# EAGLE design Dimmer_1K_0.1 (EAGLE 5.04)
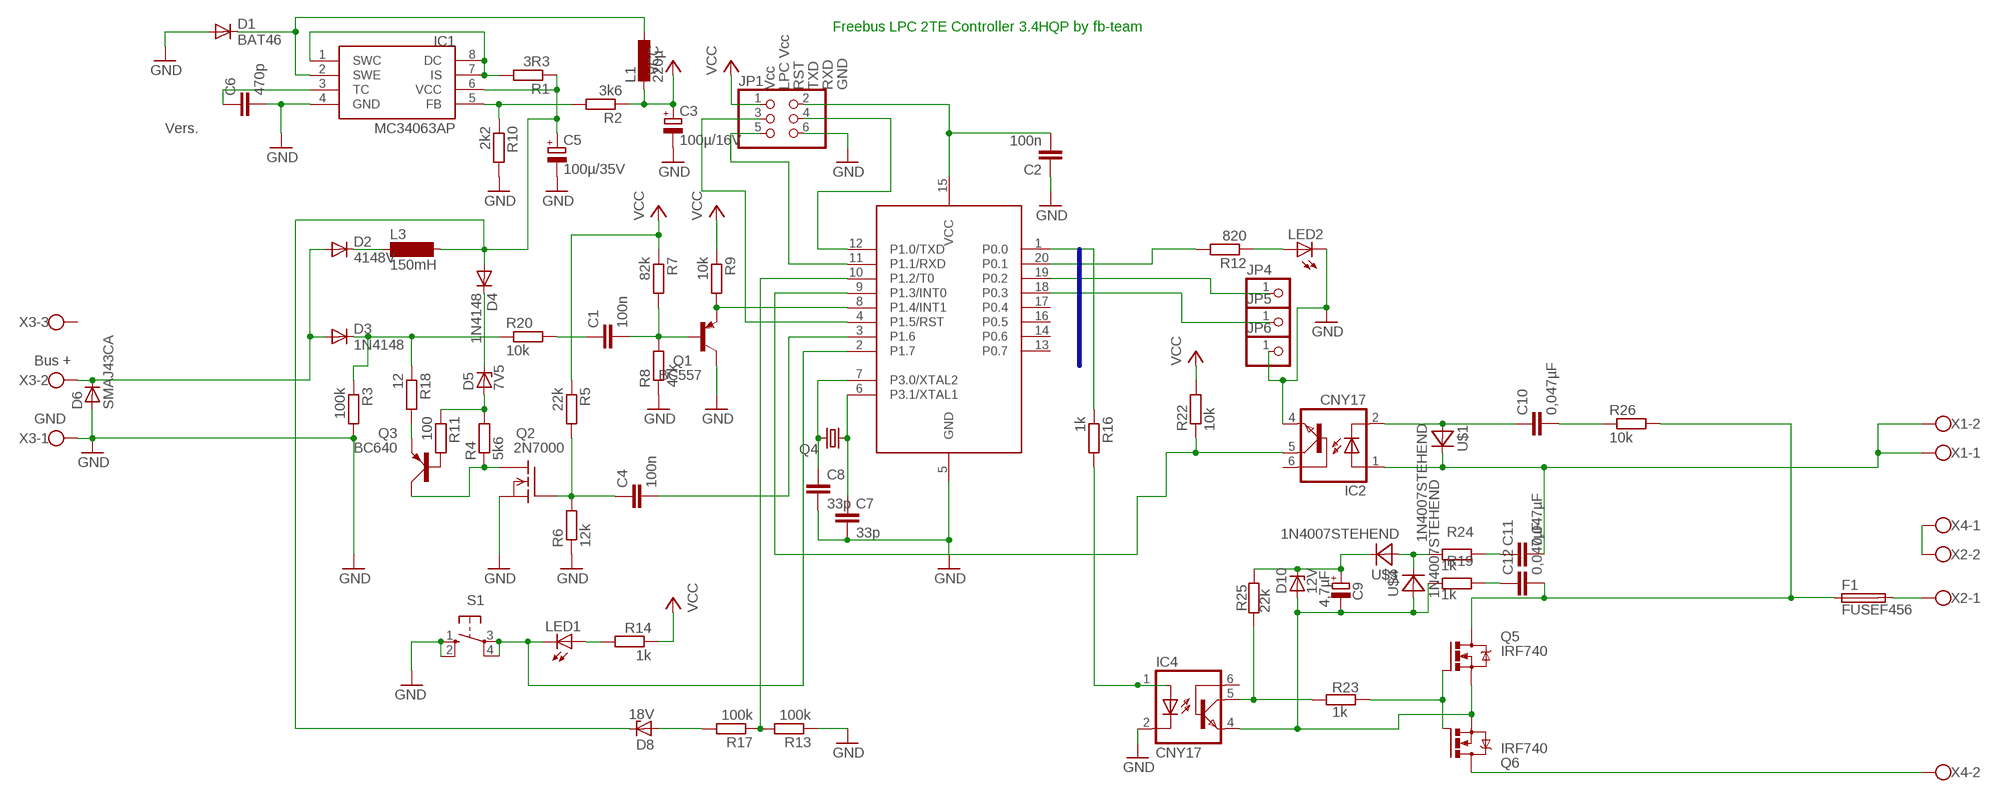
[diagram p0: schematic, sheet 1]

## Parts
C1  100n  C-EU050-024X044  [C050-024X044]
C2  100n  C-EU050-024X044  [C050-024X044]
C3  100µ/16V  CPOL-EUE2.5-5  [E2,5-5]
C4  100n  C-EU050-024X044  [C050-024X044]
C5  100µ/35V  CPOL-EUE3.5-8  [E3,5-8]
C6  470p  C-EU025-024X044  [C025-024X044]
C7  33p  C-EU025-025X050  [C025-025X050]
C8  33p  C-EU025-025X050  [C025-025X050]
C9  4,7µF  CPOL-EUE2-4  [E2-4]
C10  0,047µF  C-EU075-063X106  [C075-063X106]
C11  0,047µF  C-EU075-063X106  [C075-063X106]
C12  0,047µF  C-EU075-063X106  [C075-063X106]
D1  BAT46  BAT81  [DO34-7]
D2  4148V  1N41481448V  [D-2.5]
D3  1N4148  1N41481448V  [D-2.5]
D4  1N4148  1N41481448V  [D-2.5]
D5  7V5  ZPD  [DO35Z10]
D6  SMAJ43CA  D-SMB  [SMB]
D8  18V  ZPD  [DO35Z10]
D10  12V  ZPD  [DO35Z10]
F1  FUSEF456  [F456]
IC1  MC34063AP  [DIL08]
IC2  CNY17  [DIL06]
IC4  CNY17  [DIL06]
JP1  PINHD-2X3  [2X03]
JP4  PINHD-1X1  [1X01]
JP5  PINHD-1X1  [1X01]
JP6  PINHD-1X1  [1X01]
L1  220µ  L-EU0207/5V  [0207/5V@1]
L3  150mH  BS11  [BS11]
LED1  LED3MM  [LED3MM]
LED2  LED3MM  [LED3MM]
Q1  BC557  [TO92]
Q2  2N7000  VN2222KM  [TO237]
Q3  BC640  [SOT54D]
Q4  CRYSTALHC49S  [HC49/S]
Q5  IRF740  [TO220BV]
Q6  IRF740  [TO220BV]
R1  3R3  R-EU_0207/2V  [0207/2V]
R2  3k6  R-EU_0207/5V  [0207/5V]
R3  100k  R-EU_0207/2V  [0207/2V]
R4  5k6  R-EU_0207/2V  [0207/2V]
R5  22k  R-EU_0207/2V  [0207/2V]
R6  12k  R-EU_0207/2V  [0207/2V]
R7  82k  R-EU_0207/2V  [0207/2V]
R8  47k  R-EU_0207/2V  [0207/2V]
R9  10k  R-EU_0207/2V  [0207/2V]
R10  2k2  R-EU_0207/2V  [0207/2V]
R11  100  R-EU_0207/2V  [0207/2V]
R12  820  R-EU_0207/2V  [0207/2V]
R13  100k  R-EU_0207/5V  [0207/5V]
R14  1k  R-EU_0207/2V  [0207/2V]
R16  1k  R-EU_0207/2V  [0207/2V]
R17  100k  R-EU_0207/5V  [0207/5V]
R18  12  R-EU_0207/2V  [0207/2V]
R19  1k  R-EU_0207/7  [0207/7]
R20  10k  R-EU_0207/2V  [0207/2V]
R22  10k  R-EU_0207/5V  [0207/5V]
R23  1k  R-EU_0207/15  [0207/15]
R24  1k  R-EU_0207/2V  [0207/2V]
R25  22k  R-EU_0207/7  [0207/7]
R26  10k  R-EU_0207/2V  [0207/2V]
S1  10-XX  [B3F-10XX]
U1  89LPC922  [DIL20]
U$1  1N4007STEHEND  [RAD2,5]
U$3  1N4007STEHEND  [RAD2,5]
U$4  1N4007STEHEND  [RAD2,5]
X1  W237-02P  [W237-132]
X2  W237-02P  [W237-132]
X3  W237-3E  [W237-3E]
X4  W237-02P  [W237-132]

## Nets
DIMMGND: C9.- D10.A IC4.4(EMI) Q5.S Q6.S R19.1 U$4.A
EIB+: D2.A D3.A D6.1(C) X3.2
GND: C2.1 C3.- C5.- C6.2 C7.2 C8.2 D1.A D6.2(A) IC1.4(GND) IC2.4(EMI) IC4.2(C) JP1.6 JP6.1 LED2.K(C) Q1.3(C) Q2.3(S) R3.2 R6.1 R8.1 R10.2 R13.1 S1.1(S) S1.2(S1) U1.5(GND) X3.1
N$1: Q1.1(E) R9.2 U1.8(P1.4/INT1)
N$2: C1.2 Q1.2(B) R7.2 R8.2
N$3: C10.1 IC2.2(C) U$1.A
N$4: D3.C R3.1 R18.1 R20.1
N$5: C4.2 U1.3(P1.6)
N$6: C12.1 R19.2
N$7: LED1.K(C) S1.3(P) S1.4(P1) U1.2(P1.7)
N$8: IC1.1(SWC) IC1.7(IS) IC1.8(DC) R1.2
N$9: LED1.A R14.2
N$10: C5.+ D4.A D8.C IC1.6(VCC) L3.2 R1.1
N$11: IC1.5(FB) R2.2 R10.1
N$12: D1.C IC1.2(SWE) L1.1
N$13: D2.C L3.1
N$14: C6.1 IC1.3(TC)
N$15: D4.C D5.C
N$16: Q6.D X4.2
N$17: C10.2 R26.1
N$18: F1.2 X2.1
N$19: R16.1 U1.1(P0.0)
N$20: LED2.A R12.1
N$21: R12.2 U1.20(P0.1)
N$22: D8.A R17.2
N$23: X2.2 X4.1
N$24: IC2.5(COL) R22.1 U1.9(P1.3/INT0)
N$25: D5.A R4.2 R11.1
N$26: Q2.1(D) Q3.C R4.1
N$28: Q3.B R11.2
N$29: JP1.4 U1.12(P1.0/TXD)
N$30: JP1.5 U1.11(P1.1/RXD)
N$31: JP1.3 U1.4(P1.5/RST)
N$32: C2.2 JP1.2 U1.15(VCC)
N$33: Q3.E R18.2
N$34: C4.1 Q2.2(G) R5.2 R6.2
N$37: IC4.1(A) R16.2
N$38: JP4.1 U1.19(P0.2)
N$39: JP5.1 U1.18(P0.3)
N$41: C1.1 R20.2
N$45: IC4.5(COL) R23.1 R25.1
N$46: C11.1 R24.2
N$47: Q5.G Q6.G R23.2
N$49: C9.+ D10.C R25.2 U$3.C
N$50: R24.1 U$3.A U$4.C
NEUTRAL: C11.2 IC2.1(A) U$1.C X1.1 X1.2
PHASE: C12.2 F1.1 Q5.D R26.2
PWM: R13.2 R17.1 U1.10(P1.2/T0)
VCC: C3.+ JP1.1 L1.2 R2.1 R5.1 R7.1 R9.1 R14.1 R22.2
XTAL1: C7.1 Q4.1 U1.6(P3.1/XTAL1)
XTAL2: C8.1 Q4.2 U1.7(P3.0/XTAL2)
Unconnected: IC2.6(BAS) IC4.6(BAS) U1.13(P0.7) U1.14(P0.6) U1.16(P0.5) U1.17(P0.4) X3.3

## Buses
P0.[0..3]

## Notes on the sheet
- Freebus LPC 2TE Controller 3.4HQP by fb-team
- Vcc | LPC Vcc | RST | TXD | RXD | GND
- Vers.
- Bus +
- GND

## Library data of the parts
C1 C2 C4 C6-C8 C10-C12 = rcl:C-EU: CAPACITOR, European symbol
C3 C5 C9 = rcl:CPOL-EU: POLARIZED CAPACITOR, European symbol
D1 = diode:BAT81: DIODE barrier diode
D2-D4 = diode:1N4148: DIODE high speed (Philips)
D5 D8 D10 = diode:ZPD: Z DIODE 500 mW
D6 = semicon-smd-ipc:D-: DIODE unfilled
F1 = fuse:FUSE: Fuse
IC1 = mc34063:MC34063
IC2 IC4 = optocoupler:CNY17: SIEMENS OPTO COUPLER
JP1 = pinhead:PINHD-2X3: PIN HEADER
JP4-JP6 = pinhead:PINHD-1X1: PIN HEADER
L1 = rcl:L-EU: INDUCTOR, European symbol
L3 = inductor-neosid:BS: INDUCTOR nominal inductance, magnetically screened
LED1 LED2 = led:LED: LED OSRAM: - CHIPLED LG R971, LG N971, LY N971, LG Q971, LY Q971, LO R971, LY R971 LH N974, LH R974 LS Q976, LO Q976, LY Q976 LO Q996 - Hyper CHIPLED LW Q18S LB Q993, LB Q99A, LB R99A - SideLED LS A670, LO A670, LY A670, LG A670, LP A670 LB A673, LV A673, LT A673, LW A673 LH A674 LY A675 LS A676, LA A676, LO A676, LY A676, LW A676 LS A679, LY A679, LG A679 - Hyper Micro SIDELED® LS Y876, LA Y876, LO Y876, LY Y876 LT Y87S - SmartLED LW L88C, LW L88S LB L89C, LB L89S, LG L890 LS L89K, LO L89K, LY L89K LS L896, LA L896, LO L896, LY L896 - TOPLED LS T670, LO T670, LY T670, LG T670, LP T670 LSG T670, LSP T670, LSY T670, LOP T670, LYG T670 LG T671, LOG T671, LSG T671 LB T673, LV T673, LT T673, LW T673 LH T674 LS T676, LA T676, LO T676, LY T676, LB T676, LH T676, LSB T676, LW T676 LB T67C, LV T67C, LT T67C, LS T67K, LO T67K, LY T67K, LW E67C LS E67B, LA E67B, LO E67B, LY E67B, LB E67C, LV E67C, LT E67C LW T67C LS T679, LY T679, LG T679 LS T770, LO T770, LY T770, LG T770, LP T770 LB T773, LV T773, LT T773, LW T773 LH T774 LS E675, LA E675, LY E675, LS T675 LS T776, LA T776, LO T776, LY T776, LB T776 LHGB T686 LT T68C, LB T68C - Hyper Mini TOPLED® LB M676 - Mini TOPLED Santana® LG M470 LS M47K, LO M47K, LY M47K Source: http://www.osram.convergy.de - LUMILED® LXK2-PW12-R00, LXK2-PW12-S00, LXK2-PW14-U00, LXK2-PW14-V00 LXK2-PM12-R00, LXK2-PM12-S00, LXK2-PM14-U00 LXK2-PE12-Q00, LXK2-PE12-R00, LXK2-PE12-S00, LXK2-PE14-T00, LXK2-PE14-U00 LXK2-PB12-K00, LXK2-PB12-L00, LXK2-PB12-M00, LXK2-PB14-N00, LXK2-PB14-P00, LXK2-PB14-Q00 LXK2-PR12-L00, LXK2-PR12-M00, LXK2-PR14-Q00, LXK2-PR14-R00 LXK2-PD12-Q00, LXK2-PD12-R00, LXK2-PD12-S00 LXK2-PH12-R00, LXK2-PH12-S00 LXK2-PL12-P00, LXK2-PL12-Q00, LXK2-PL12-R00 Source: www.luxeon.com
Q1 = transistor-pnp:BC557: PNP Transistor
Q2 = transistor-fet:VN2222KM: N-Channel Enhancement MOSFET (VMOS); 60V; 0,5A; 7,5Ohm
Q3 = transistor-small-signal:BC640: PNP TRANSISTOR
Q4 = crystal:CRYSTAL: CRYSTAL
Q5 Q6 = transistor-power:IRF740: N-CHANNEL MOS FET
R1-R14 R16-R20 R22-R26 = rcl:R-EU_: RESISTOR, European symbol
S1 = switch-omron:10-XX: OMRON SWITCH
U1 = micro-philips:89LPC922
U$1 U$3 U$4 = diode:1N4007
X1 X2 X4 = con-wago-508:W237-02P: WAGO SREW CLAMP
X3 = con-wago-508:W237-3E: WAGO SREW CLAMP

## Board
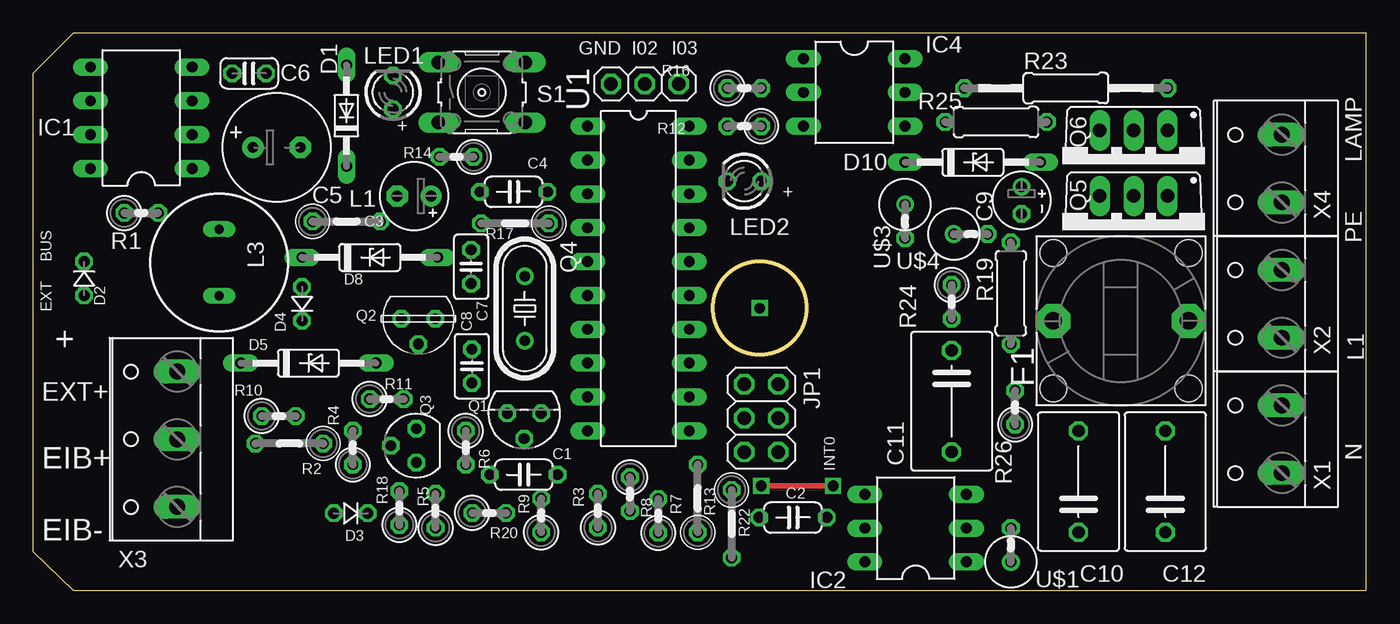
[diagram p1: board, top side]
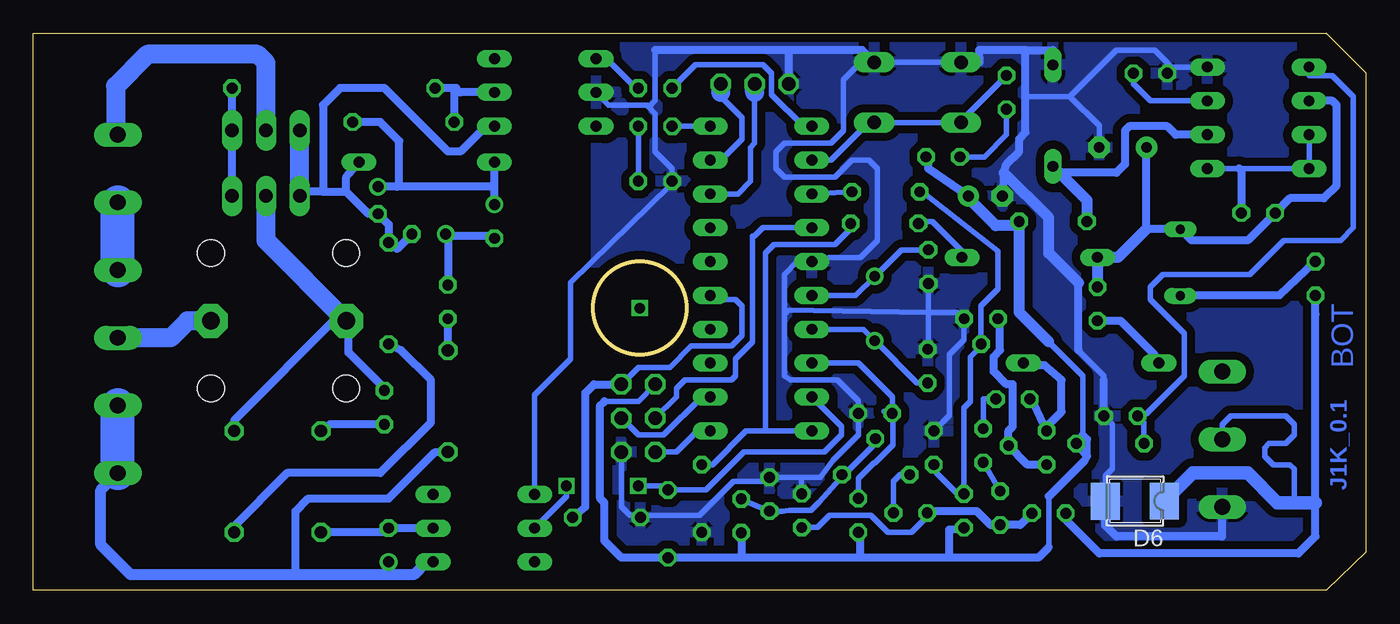
[diagram p2: board, bottom side, seen from below]

Size 100 x 41.8 mm. Coordinates in mm from the lower left corner, seen from the top.
Outline: 0,2.9 3,0 100,0 100,41.8 3,41.8 0,38.8 0,2.9
Outline: circle at 54.5,21.17 radius 3.49
Copper layers (1*16): Top 0.035mm / dielectric 1.5mm / Bottom 0.035mm
Design rules "default *": minimum track width 10mil, minimum drill 24mil, track to track 8mil, track to pad 8mil, pad to pad 8mil, via to via 8mil, smd to smd 8mil, copper to edge 25mil, drill to drill 8mil, minimum pad ring 10mil, minimum via ring 8mil, stop-mask expansion 4mil, vias tented up to drill 0mil, thermal gap 10mil

### Footprints (pad centres in the part's own frame; a part is rotated, then mirrored left to right if it is on the bottom)
C050-024X044 = drill 0.813 octagon: 1 -2.54,0; 2 2.54,0
E2,5-5 = drill 0.813 pad 1.6 round: + -1.27,0 | drill 0.813 pad 1.6 octagon: - 1.27,0
E3,5-8 = drill 0.813 pad 1.6 round: + -1.778,0 | drill 0.813 pad 1.6 octagon: - 1.778,0
C025-024X044 = drill 0.813 octagon: 1 -1.27,0; 2 1.27,0
C025-025X050 = drill 0.813 octagon: 1 -1.27,0; 2 1.27,0
E2-4 = drill 0.813 pad 1.27 round: + -1.016,0 | drill 0.813 pad 1.27 octagon: - 1.016,0
C075-063X106 = drill 0.914 octagon: 1 -3.81,0; 2 3.81,0
DO34-7 = drill 0.813 long: A 3.81,0; C -3.81,0
D-2.5 = drill 0.813 octagon: A 1.27,0; C -1.27,0
DO35Z10 = drill 0.813 long: A 5.08,0; C -5.08,0
SMB = smd 2.159 x 2.743: 1 -2.311,-0.127; 2 2.108,-0.102
F456 = drill 1.321 pad 2.54 octagon: 1 0,5.08; 2 0,-5.08 | hole 2.007: 5.08,5.08; 5.08,-5.08; -5.08,-5.08; -5.08,5.08
DIL08 = drill 0.813 long: 1 -3.81,-3.81; 2 -1.27,-3.81; 3 1.27,-3.81; 4 3.81,-3.81; 5 3.81,3.81; 6 1.27,3.81; 7 -1.27,3.81; 8 -3.81,3.81
DIL06 = drill 0.813 long: 1 -2.54,-3.81; 2 0,-3.81; 3 2.54,-3.81; 4 2.54,3.81; 5 0,3.81; 6 -2.54,3.81
2X03 = drill 1.016 octagon: 1 -2.54,-1.27; 2 -2.54,1.27; 3 0,-1.27; 4 0,1.27; 5 2.54,-1.27; 6 2.54,1.27
1X01 = drill 1.016 octagon: 1 0,0
0207/5V@1 = drill 0.813 octagon: 1 -2.54,0; 2 2.54,0
BS11 = drill 0.7 long: 1 -2.5,0; 2 2.5,0
LED3MM = drill 0.813 octagon: A -1.27,0; K 1.27,0
TO92 = drill 0.813 octagon: 1 1.27,0; 2 0,1.905; 3 -1.27,0
TO237 = drill 0.813 octagon: 1 1.27,0; 2 0,1.905; 3 -1.27,0
SOT54D = drill 0.813 octagon: B 1.27,0; C 0,1.905; E -1.27,0
HC49/S = drill 0.813 round: 1 -2.413,0; 2 2.413,0
TO220BV = drill 1.016 long: D 0,-2.54; G -2.54,-2.54; S 2.54,-2.54
0207/2V = drill 0.813 octagon: 1 -1.27,0; 2 1.27,0
0207/5V = drill 0.813 octagon: 1 -2.54,0; 2 2.54,0
0207/7 = drill 0.813 octagon: 1 -3.81,0; 2 3.81,0
0207/15 = drill 0.813 octagon: 1 -7.62,0; 2 7.62,0
B3F-10XX = drill 1.016 long: 1 -3.251,2.261; 2 3.251,2.261; 3 -3.251,-2.261; 4 3.251,-2.261
DIL20 = drill 0.813 long: 1 -11.43,-3.81; 2 -8.89,-3.81; 3 -6.35,-3.81; 4 -3.81,-3.81; 5 -1.27,-3.81; 6 1.27,-3.81; 7 3.81,-3.81; 8 6.35,-3.81; 9 8.89,-3.81; 10 11.43,-3.81; 11 11.43,3.81; 12 8.89,3.81; 13 6.35,3.81; 14 3.81,3.81; 15 1.27,3.81; 16 -1.27,3.81; 17 -3.81,3.81; 18 -6.35,3.81; 19 -8.89,3.81; 20 -11.43,3.81
RAD2,5 = drill 0.813 octagon: A 1.27,0 | drill 0.813 round: C -1.27,0
W237-132 = drill 1.194 long: 1 -2.54,-0.635; 2 2.54,-0.635
W237-3E = drill 1.194 long: 1 -5.08,-0.635; 2 0,-0.635; 3 5.08,-0.635

### Placement (x,y rotation side)
C1  36.8,8.67 0 top
C2  56.99,5.46 0 top
C3  28.57,29.59 180 top
C4  36.04,29.9 0 top
C5  18.26,33.24 0 top
C6  16.19,38.79 180 top
C7  32.85,24.28 270 top
C8  32.9,16.82 90 top
C9  74.14,29.27 270 top
C10  78.42,8.16 90 top
C11  68.9,14.19 270 top
C12  84.93,8.16 90 top
D1  23.5,35.62 90 top
D2  3.81,23.39 270 top
D3  23.81,5.77 180 top
D4  20.16,21.49 90 top
D5  20.64,17.04 0 top
D6  17.46,6.57 180 bottom
D8  25.24,24.98 0 top
D10  70.48,32.13 0 top
F1  81.6,20.22 90 top
IC1  8.1,35.46 90 top
IC2  66.2,4.66 90 top
IC4  61.59,37.37 270 top
JP1  54.61,12.92 270 top
JP4  48.42,38 0 top
JP5  45.88,38 0 top
JP6  43.34,38 0 top
L1  23.5,27.68 0 top
L3  13.94,24.6 90 top
LED1  26.99,37.37 90 top
LED2  53.34,30.7 180 top
Q1  36.83,13.28 180 top
Q2  28.89,20.38 180 top
Q3  28.73,10.85 90 top
Q4  36.87,21.14 270 top
Q5  82.55,27.05 180 top
Q6  82.55,31.97 180 top
R1  8.1,28.32 0 top
R2  19.21,11.01 180 top
R3  42.36,5.97 90 top
R4  23.97,10.69 90 top
R5  30.18,5.96 90 top
R6  32.44,10.7 270 top
R7  46.89,5.58 90 top
R8  44.77,7.2 270 top
R9  38.1,5.61 90 top
R10  18.42,13.08 0 top
R11  26.51,14.35 0 top
R12  53.34,34.82 180 top
R13  49.85,6.88 90 top
R14  31.75,32.52 180 top
R16  53.34,37.68 0 top
R17  36.14,27.53 180 top
R18  27.46,6.17 90 top
R19  73.34,22.28 270 top
R20  34.2,5.8 0 top
R22  52.39,4.98 270 top
R23  77.47,37.68 0 top
R24  68.9,21.65 270 top
R25  72.23,35.14 0 top
R26  73.66,13.71 90 top
S1  33.66,37.36 0 top
U1  45.4,23.39 270 top
U$1  73.34,3.39 90 top
U$3  65.4,27.68 270 top
U$4  70.33,26.73 0 top
X1  93.03,11.33 90 top
X2  93.03,21.49 90 top
X3  10.16,11.33 90 top
X4  93.03,31.65 90 top

### Tracks (layer width: path | path; a pad name or v marks a point on that pad's centre or on a via)
DIMMGND
  Bottom 0.61: U$4.A 72.71,25.62 R19.1 73.34,27.46 C9.- 74.87,28.25 76.52,29.9 | 76.52,29.9 76.52,31.01 D10.A | Q5.S 79.85,29.59 79.53,29.9 78.26,29.9 | 78.26,29.9 76.52,29.9 | IC4.4 66.04,34.82 67.94,32.92 68.9,32.92 73.66,37.68 76.99,37.68 78.26,36.41 78.26,29.9
  Bottom 1.422: Q5.S Q6.S
EIB+
  Bottom 0.406: X3.2 10.79,12.44 10.16,13.08 6.03,13.08 5.4,12.44 5.4,11.65 6.03,11.01 7.3,11.01 7.62,10.7 7.62,10.06 6.99,9.43 5.71,9.43 5.4,9.11 5.4,6.57
  Bottom 0.61: D3.A 22.54,5.3 20,2.76 5.08,2.76 3.81,4.03 3.81,6.57 3.81,20.7 D2.A
  Bottom 1.016: D6.1 15.11,6.7 13.02,8.79 8.89,8.79 6.67,6.57 5.4,6.57 3.81,6.57
GND
  Bottom 0.406: U1.5 42.7,24.66 43.66,23.71 43.66,21.01 | 42.23,8.47 40.96,8.47 40.01,9.74 38.1,11.65 Q1.3 38.1,14.19 39.69,15.78 43.18,15.78 43.66,16.09 43.66,18.63 43.66,18.79 43.66,21.01 | 42.23,8.47 R8.1 45.09,8.16 47.47,8.16 50.01,5.62 54.29,5.62 C2.1 54.61,5.62 55.24,5.62 55.88,6.25 JP1.6 | Q2.3 | 43.66,21.01 43.5,20.85 | U1.5 | U1.5 40.64,24.66 40.32,24.98 37.94,24.98 36.67,26.25 36.67,31.65 37.31,32.28 38.58,32.28 39.85,31.01 43.66,31.01 44.29,31.65 44.29,32.92 43.66,33.55 40.16,33.55 39.21,34.51 39.21,38.32 37.9,39.62 S1.2 S1.1 | R6.1 31.27,13.13 31.27,17.68 30.16,18.79 Q2.3 | Q2.3 30.64,20.85 32.86,20.85 | 43.66,21.01 32.86,20.85 | C7.2 32.86,20.85 | C8.2 32.86,18.09 32.86,20.85 | R10.2 19.05,12.44 19.05,9.11 19.57,8.59 D6.2 | 19.68,15.78 19.68,16.09 21.59,18 | C5.- 20.03,34.86 22.23,37.05 | 25.56,37.05 22.23,37.05 | 14.76,38.63 C6.2 14.92,39.59 | 14.92,39.59 15.88,40.54 18.73,40.54 22.23,37.05 | IC1.4 14.61,39.27 14.92,39.59 | R3.2 42.35,8.35 42.23,8.47 | 53.82,36.25 53.34,35.78 53.34,32.92 52.07,31.65 LED2.K 52.23,30.54 52.23,30.38 59.69,23.08 59.69,17.36 62.39,14.66 IC2.4 | 53.82,36.25 53.98,36.41 56.83,36.41 IC4.2 | 53.34,40.54 53.34,36.73 53.82,36.25
  Bottom 0.61: 25.56,40.54 23.5,40.54 23.5,39.75 | 25.56,40.54 29.05,40.54 29.01,39.62 S1.1 | X3.1 10.79,4.03 18.73,4.03 19.57,4.87 D6.2 | 43.34,40.54 37.82,40.54 S1.2 | 43.34,40.54 53.34,40.54 | 43.34,40.54 JP6.1 | 19.68,15.78 19.68,15.14 R10.2 | C3.- 27.17,31.31 26.99,31.97 26.04,32.92 26.04,33.87 25.56,34.35 25.56,37.05 25.56,40.54 | 21.59,18 21.59,23.08
  Bottom 0.813: 21.59,23.08 23.81,25.3 23.81,27.95 27.17,31.31
  pour Bottom (isolate 0.61): 0.64,38.48 0.64,38.63 3.17,41.17 57.78,41.17 57.78,1.01 58.26,0.54 3.33,0.54 0.64,3.23
N$1
  Bottom 0.406: R9.2 38.1,8.39 36.91,9.57 36.85,9.57 35.51,10.91 35.51,13.41 36.17,13.44 Q1.1 35.56,14.51 38.1,17.04 U1.8 | U1.8
N$2
  Bottom 0.406: 39.62,8.69 39.31,8.36 C1.2 39.48,8.36 | 39.48,8.36 39.48,8.69 | 39.48,8.36 41.06,6.61 41.66,6.01 43.27,6.01 43.82,5.93 R8.2 46.29,6.57 R7.2 | 39.48,8.36 38.85,8.99 36.51,11.33 36.87,11.33 Q1.2
N$3
  Bottom 0.61: C10.1 73.66,4.35 U$1.A IC2.2
N$4
  Bottom 0.406: R3.1 42.27,4.7 42.27,4.71 41.16,4.71 40.27,5.61 37.16,5.61 35.9,4.35 34.13,4.35 32.93,5.54 R20.1 32.8,5.93
  Bottom 0.61: 32.8,5.93 29.21,5.93 28.18,4.9 R18.1 25.96,4.9 D3.C
N$5
  Bottom 0.406: U1.3 | C4.2 U1.3 | U1.3
N$6
  Bottom 0.61: C12.1 85.09,4.66 80.96,8.79 73.98,8.79 70.17,12.6 70.17,15.78 72.39,18 R19.2
N$7
  Bottom 0.406: U1.2 | U1.2 40.16,32.28 37.34,35.1 S1.4 S1.3 30.4,35.22 LED1.K
N$8
  Bottom 0.406: IC1.1 9.84,31.65 9.53,31.65 IC1.8 IC1.7
  Bottom 0.61: R1.2 9.37,31.49 9.53,31.65
N$9
  Bottom 0.406: LED1.A 26.99,34.19 28.65,32.52 R14.2
N$10
  Bottom 0.61: R1.1 | R1.1 8.89,26.25 13.1,26.25 L3.2 16.51,27.1 16.48,27.13 C5.+ | R1.1 5.71,29.43 3.17,29.43 2.22,30.38 2.22,36.41 2.54,36.73 IC1.6 | IC1.6 | D4.A 20.32,22.92
  Bottom 0.813: 16.51,27.1 18.63,24.98 D8.C D4.A | D4.A
N$11
  Bottom 0.406: R2.2 16.67,12.6 R10.1 16.51,13.24 13.65,16.09 13.65,19.27 16.19,21.81 16.19,22.76 15.24,23.71 8.73,23.71 6.19,26.25 1.91,26.25 0.95,27.2 0.95,37.05 2.54,38.63 4.29,38.63 IC1.5
N$12
  Bottom 0.61: IC1.2 14.29,34.19 14.92,34.82 17.78,34.82 18.1,34.51 18.1,31.97 18.73,31.33 23.02,31.33 23.1,31.41 D1.C
  Bottom 0.813: L1.1 20.95,29.27 23.1,31.41
N$13
  Bottom 0.61: D2.C 6.51,22.12 13.28,22.12 L3.1
N$14
  Bottom 0.406: IC1.3 16.19,36.73 17.46,38 C6.1
N$15
  Bottom 0.406: 15.88,17.68 15.88,17.36 D5.C
  Bottom 0.61: 15.88,17.68 18.41,20.22 D4.C | D4.C
N$16
  Bottom 1.422: Q6.D 82.55,39.59 83.19,40.22 91.44,40.22 93.82,37.84 93.82,34.35 X4.2
N$17
  Bottom 0.61: R26.1 77.79,12.44 78.26,11.96 C10.2
N$18
  Bottom 1.422: F1.2 88.42,20.22 89.69,18.95 X2.1
N$19
  Bottom 0.406: U1.1 42.23,34.82 44.61,37.21 44.61,38.79 45.24,39.43 50.32,39.43 R16.1
N$20
  Bottom 0.406: LED2.A R12.1
N$21
  Bottom 0.406: U1.20 R12.2 | U1.20
N$22
  Bottom 0.406: D8.A 30.32,25.46 32.54,27.68 33.59,27.68 R17.2
N$23
  Bottom 2.54: X2.2 X4.1
N$24  (via drill 0.8)
  Top 0.406: v54.61,7.84 v60.01,7.84
  Bottom 0.406: U1.9 39.37,12.28 39.37,11.65 40.64,10.38 46.67,10.38 49.53,7.52 R22.1 52.55,7.52 52.86,7.84 v54.61,7.84 | v60.01,7.84 60.01,7.04 IC2.5
N$25
  Bottom 0.406: D5.A 25.88,17.04 26.04,16.89
  Bottom 0.61: R11.1 24.92,14.03 24.18,12.42 | R4.2 24.18,12.42 | 24.18,12.42 23.84,12.42 22.86,13.39 22.86,15.78 24.13,16.89 26.04,16.89
N$26
  Bottom 0.61: R4.1 25.4,9.43 Q3.C 26.83,11.96 26.51,12.28 26.51,15.46 26.99,15.46 27.94,16.41 27.94,17.52 27.46,18 27.46,20.22 Q2.1
N$28
  Bottom 0.406: Q3.B 28.73,14.35 R11.2
N$29
  Bottom 0.406: JP1.4 54.61,11.65 52.7,11.65 49.85,14.51 U1.12 | U1.12
N$30
  Bottom 0.406: U1.11 50.16,11.96 51.75,10.38 JP1.5
N$31
  Bottom 0.406: U1.4 45.24,27.2 45.88,26.57 46.04,26.57 46.04,18.63 47.31,17.36 47.31,16.09 47.62,15.78 51.12,15.78 51.75,15.14 51.75,14.51 JP1.3
N$32
  Bottom 0.406: U1.15 48.9,21.81 47.31,21.81 46.83,21.33 46.83,19.11 47.62,18.31 50.64,18.31 52.23,16.73 54.61,16.73 JP1.2
  Bottom 0.61: JP1.2 57.94,15.46 58.58,14.82 58.58,6.25 C2.2
N$33
  Bottom 0.406: R18.2 Q3.E
N$34
  Bottom 0.406: 28.89,18.31 | Q2.2 | Q2.2 28.89,18.31 | Q2.2 | Q2.2 28.89,21.33 27.62,22.6 27.62,25.46 33.34,29.9 C4.1 | R6.2 32.23,8.79 30.66,7.23 R5.2 30.18,13.69 29.69,14.19 29.69,17.52 28.89,18.31 | 28.89,18.31 Q2.2
N$37
  Bottom 0.406: R16.2 54.77,37.68 56.99,39.91 IC4.1
N$38
  Bottom 0.406: U1.19 48.42,32.28 46.83,33.87 46.83,35.46 48.42,37.05 48.42,37.37
  Bottom 1.422: 48.42,37.37 JP4.1
N$39
  Bottom 0.406: U1.18 47.15,29.74 46.2,30.7 46.2,33.24 45.88,33.55 45.88,37.37 | U1.18
  Bottom 1.422: 45.88,37.37 JP5.1
N$40  (via drill 0.8)
  other vias: 54.5,21.17
N$41
  Bottom 0.406: C1.1 34.92,8.67 34.94,8.69 35.47,8.16 R20.2
N$45
  Bottom 0.61: 68.42,37.52 R25.1 | 68.42,37.52 68.26,37.68 R23.1 | IC4.5 67.94,37.37 68.42,37.52
N$46
  Bottom 0.61: C11.1 R24.2
N$47
  Bottom 0.61: Q5.G Q6.G R23.2
N$49
  Bottom 0.61: U$3.C 65.41,30.54 | 65.41,30.54 D10.C | 72.71,30.29 65.66,30.29 65.41,30.54 | 72.71,30.29 C9.+ | R25.2 73.98,35.14 72.55,33.71 72.55,30.44 72.71,30.29
N$50
  Bottom 0.61: 68.9,26.57 R24.1 | 68.9,26.57 U$4.C | 68.9,26.57 65.56,26.57 U$3.A
NEUTRAL
  Bottom 0.61: C11.2 69.85,10.38 73.34,6.89 79.38,6.89 80.33,5.93 80.33,1.17
  Bottom 0.813: IC2.1 70.48,2.12 71.44,1.17 73.34,1.17 | 73.34,1.17 80.33,1.17 92.71,1.17 94.93,3.39 94.93,7.52 X1.1 | 73.34,1.17 U$1.C
  Bottom 2.54: X1.1 X1.2
PHASE
  Bottom 0.61: C12.2 84.93,12.76 77.15,20.54 F1.1 76.36,19.74 76.36,17.84 73.66,15.14 R26.2
  Bottom 1.422: Q5.D 82.55,26.25 F1.1
PWM
  Bottom 0.406: U1.10 41.75,12.12 | R17.1 38.68,27.1 39.85,25.93 44.45,25.93 45.09,25.3 45.09,11.96 | U1.10 45.09,11.96 | U1.10 | R13.2 49.05,9.43 46.51,11.96 45.09,11.96
VCC
  Bottom 0.406: 46.6,4.29 R7.1 | R5.1 31.11,4.66 | 23.81,3.23 23.81,7.04 | 21.27,11.65 21.27,16.09 23.81,18.63 | 57.15,14.19 54.61,14.19 JP1.1
  Bottom 0.61: 31.27,2.44 37.94,2.44 | 37.94,2.44 46.83,2.44 | 46.6,4.29 46.83,4.2 46.83,2.44 | R9.1 37.94,4.19 37.94,2.44 | R5.1 31.27,4.55 31.27,2.44 | R14.1 32.86,32.37 32.86,31.65 C3.+ 29.84,29.43 | 20.95,10.06 21.11,9.74 23.81,7.04 | 20.95,10.06 R2.1 | 23.81,3.23 24.61,2.44 31.27,2.44 | 20.95,10.06 20.95,11.33 21.27,11.65 | 46.83,2.44 R22.2 55.88,2.44 57.15,3.71 57.15,6.57 57.47,6.89 57.47,13.87 57.15,14.19
  Bottom 0.813: 23.81,18.63 26.04,20.85 L1.2 | L1.2 | 29.84,29.43 28.73,28.32 27.78,27.36 26.35,27.36 L1.2
XTAL1
  Bottom 0.406: U1.6 | U1.6 38.3,22.12 Q4.1 34.88,25.55 C7.1
XTAL2
  Bottom 0.406: Q4.2 36.77,18.63 | U1.7 37.72,19.58 Q4.2 | C8.1 33.69,15.55 Q4.2

### Text on the board
Bottom: BOT | J1K_0.1
tPlace: GND | I02 | I03 | LAMP | + | + | PE | BUS | EXT | + | L1 | EXT+ | N | EIB+ | INT0 | EIB-
tDocu: bei 1N4007 Dioden Ring nach unten